# Altium schematic sheet SysUprTestUUConn.SchDoc
size 594 x 420 mm; DecimalNumber: Э- 917.04Э3; MainDevice: Плата сопряжения; Name: Плата сопряжения; PageSetup: Record=PageOptions|CenterHorizontal=True|CenterVertical=True|PrintScale=0.94|XCorrection=1.00|YCorrection=1.00|PrintKind=1|BorderSize=5000000|LeftOffset=0|BottomOffset=0|Orientation=1|PaperLength=1000|PaperWidth=1000|Scale=100|PaperSource=7|PrintQuality=-4|MediaType=1|DitherType=10|PaperKind=A4|PrintScaleMode=1; ApprovedBy: Кайбалдиев; CheckedBy: Савельев; DrawnBy: Соловьев; Engineer: Т.контр.; DocumentNumber: Э-917.04Э3; SheetTotal: 1; Title1str: Плата сопряжения; DocumentType1str: Схема электрическая; DocumentType2str: принципиальная; ImagePath: Э-917.04
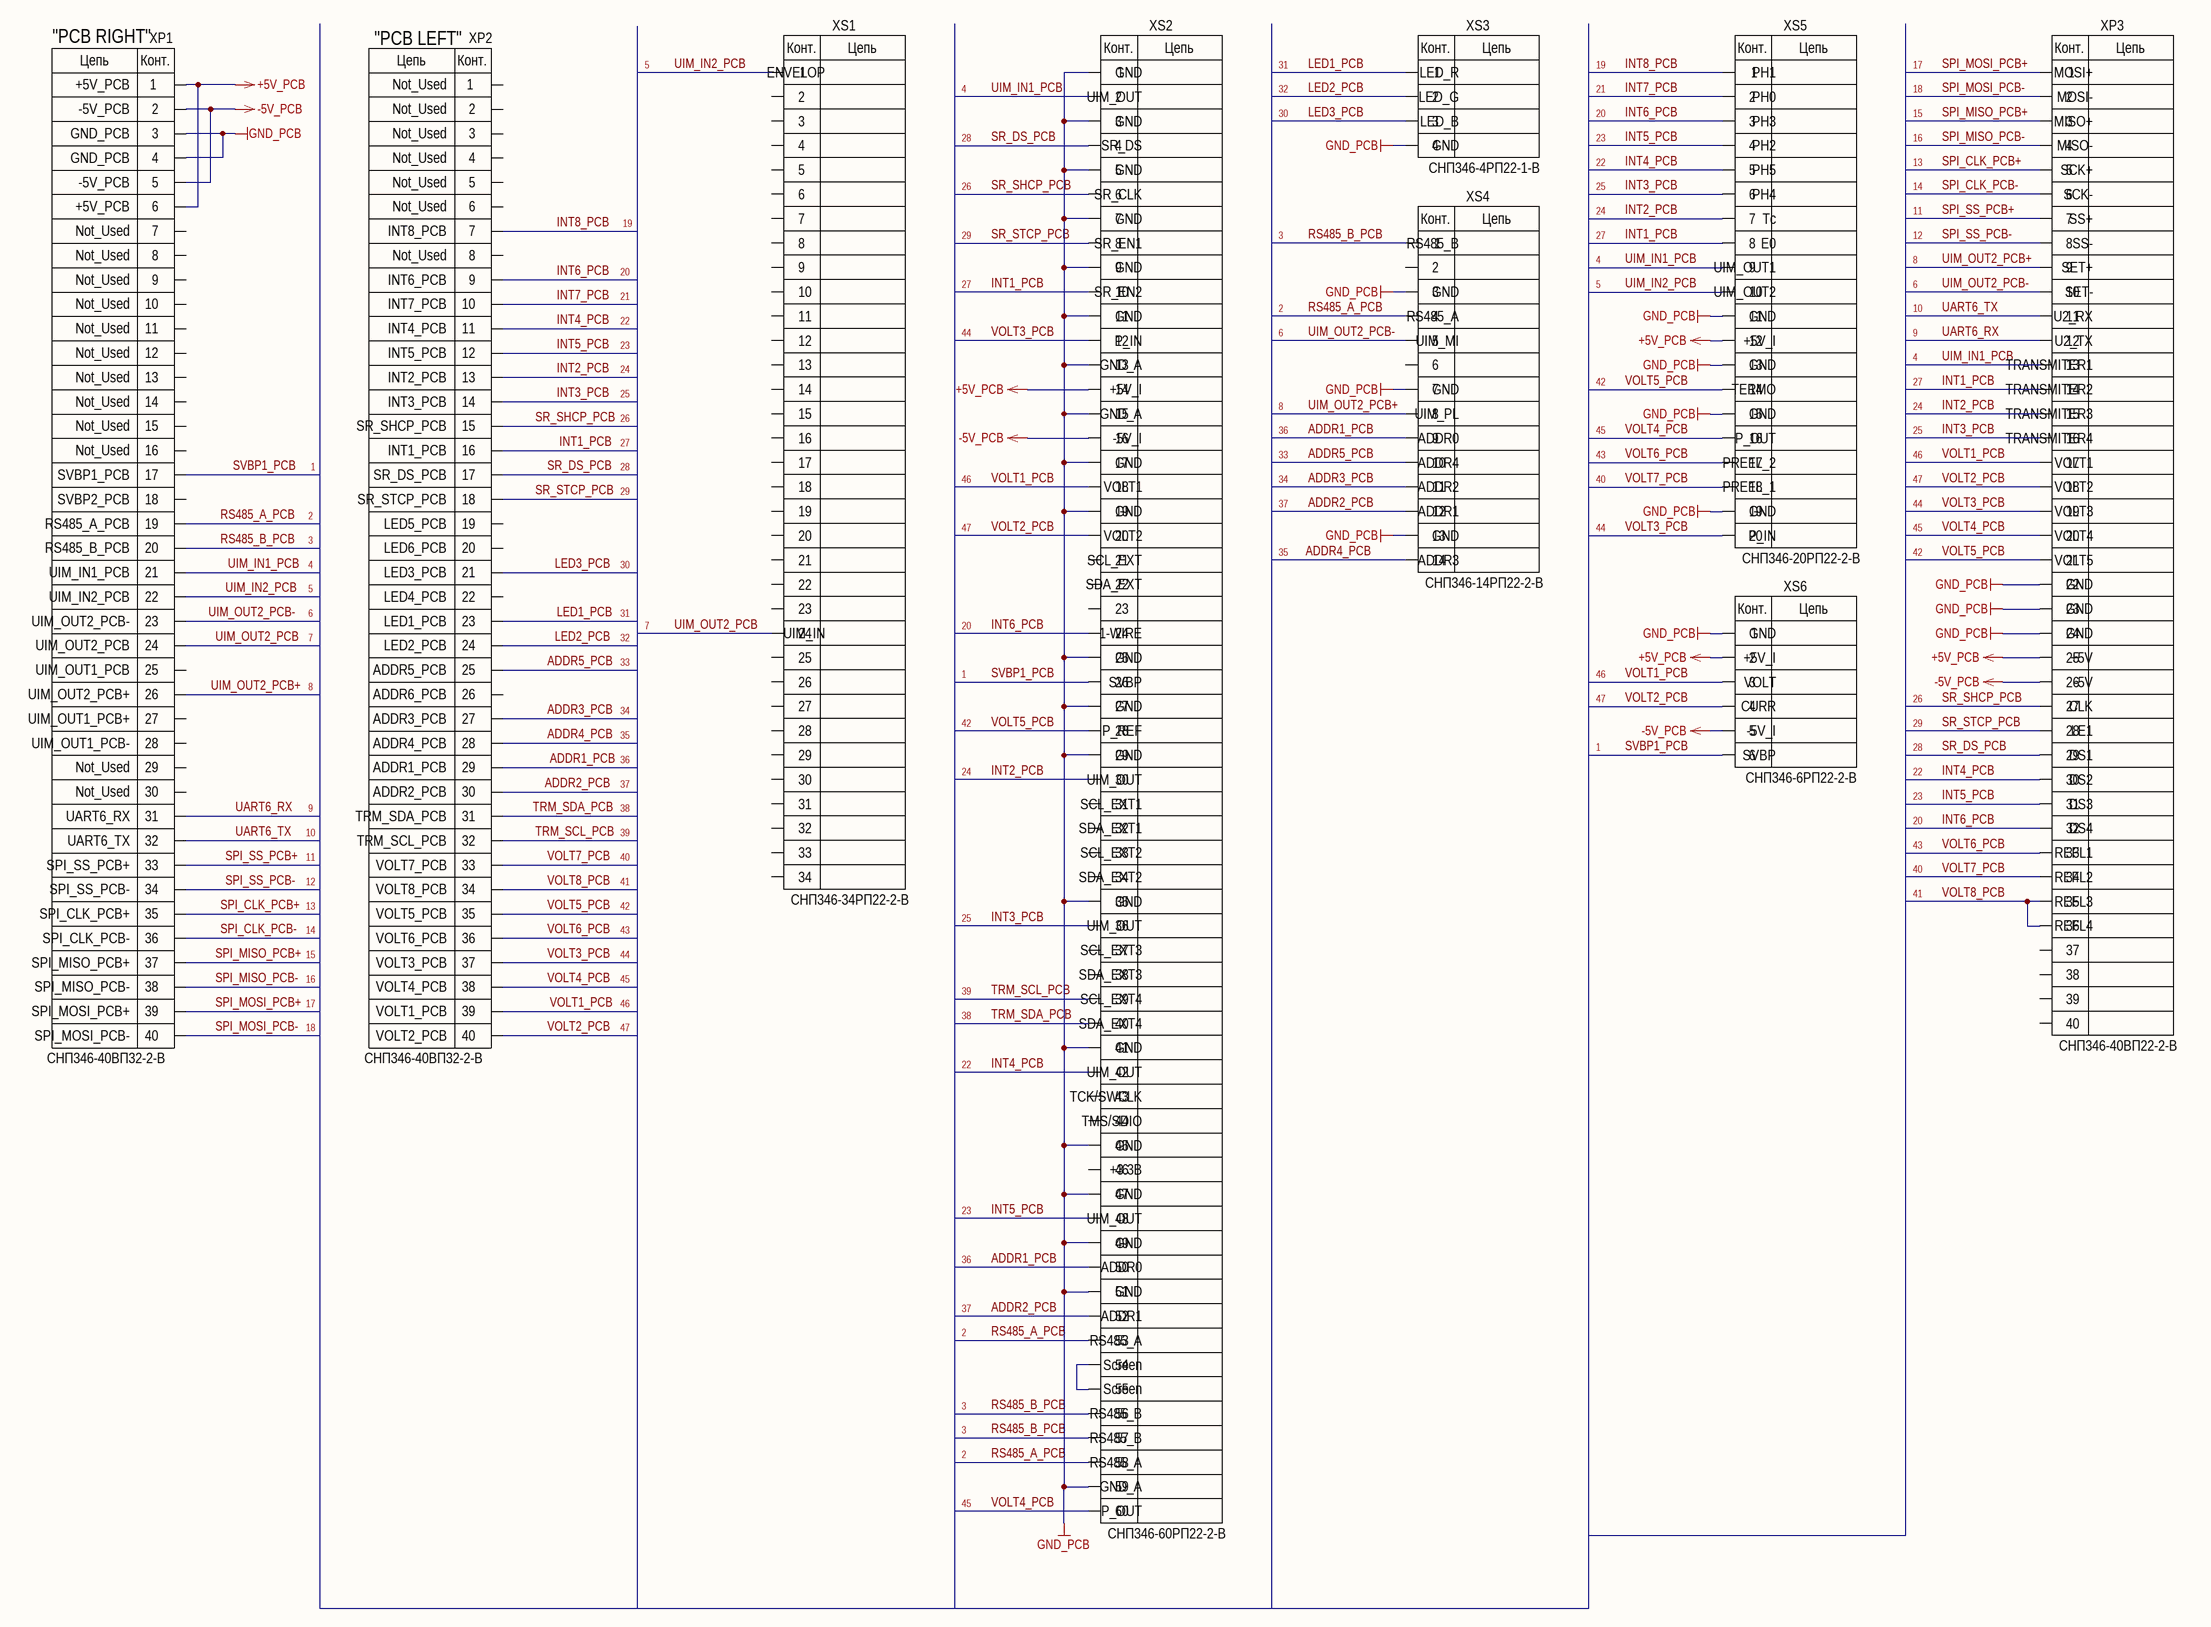
[diagram p0: SysUprTestUUConn.SchDoc]

## Parts
XP1  ConnectorP40  [PLD-40R]  (value not drawn)
XP2  ConnectorP40  [PLD-40R]  (value not drawn)
XP3  ConnectorP40  [PLD-40]  (value not drawn)
XS1  ConnectorS34  [PBD-34]  (value not drawn)
XS2  ConnectorS60  [PBD-60]  (value not drawn)
XS3  ConnectorS4  [PBS-4]  (value not drawn)
XS4  ConnectorS14  [PBD-14]  (value not drawn)
XS5  ConnectorS20  [PBD-20]  (value not drawn)
XS6  ConnectorS6  [PBD-6]  (value not drawn)

## Nets
+5V_PCB: XP1.1 XP1.6 XP3.25 XS2.14 XS5.12 XS6.2
-5V_PCB: XP1.2 XP1.5 XP3.26 XS2.16 XS6.5
GND_PCB: XP1.3 XP1.4 XP3.22 XP3.23 XP3.24 XS2.1 XS2.3 XS2.5 XS2.7 XS2.9 XS2.11 XS2.13 XS2.15 XS2.17 XS2.19 XS2.25 XS2.27 XS2.29 XS2.35 XS2.41 XS2.45 XS2.47 XS2.49 XS2.51 XS2.59 XS3.4 XS4.3 XS4.7 XS4.13 XS5.11 XS5.13 XS5.15 XS5.19 XS6.1
ADDR1_PCB: XP2.29 XS2.50 XS4.9
ADDR2_PCB: XP2.30 XS2.52 XS4.12
ADDR3_PCB: XP2.27 XS4.11
ADDR4_PCB: XP2.28 XS4.14
ADDR5_PCB: XP2.25 XS4.10
INT1_PCB: XP2.16 XP3.14 XS2.10 XS5.8
INT2_PCB: XP2.13 XP3.15 XS2.30 XS5.7
INT3_PCB: XP2.14 XP3.16 XS2.36 XS5.6
INT4_PCB: XP2.11 XP3.30 XS2.42 XS5.5
INT5_PCB: XP2.12 XP3.31 XS2.48 XS5.4
INT6_PCB: XP2.9 XP3.32 XS2.24 XS5.3
INT7_PCB: XP2.10 XS5.2
INT8_PCB: XP2.7 XS5.1
LED1_PCB: XP2.23 XS3.1
LED2_PCB: XP2.24 XS3.2
LED3_PCB: XP2.21 XS3.3
RS485_A_PCB: XP1.19 XS2.53 XS2.58 XS4.4
RS485_B_PCB: XP1.20 XS2.56 XS2.57 XS4.1
SPI_CLK_PCB+: XP1.35 XP3.5
SPI_CLK_PCB-: XP1.36 XP3.6
SPI_MISO_PCB+: XP1.37 XP3.3
SPI_MISO_PCB-: XP1.38 XP3.4
SPI_MOSI_PCB+: XP1.39 XP3.1
SPI_MOSI_PCB-: XP1.40 XP3.2
SPI_SS_PCB+: XP1.33 XP3.7
SPI_SS_PCB-: XP1.34 XP3.8
SR_DS_PCB: XP2.17 XP3.29 XS2.4
SR_SHCP_PCB: XP2.15 XP3.27 XS2.6
SR_STCP_PCB: XP2.18 XP3.28 XS2.8
SVBP1_PCB: XP1.17 XS2.26 XS6.6
TRM_SCL_PCB: XP2.32 XS2.39
TRM_SDA_PCB: XP2.31 XS2.40
UART6_RX: XP1.31 XP3.12
UART6_TX: XP1.32 XP3.11
UIM_IN1_PCB: XP1.21 XP3.13 XS2.2 XS5.9
UIM_IN2_PCB: XP1.22 XS1.1 XS5.10
UIM_OUT2_PCB: XP1.24 XS1.24
UIM_OUT2_PCB+: XP1.26 XP3.9 XS4.8
UIM_OUT2_PCB-: XP1.23 XP3.10 XS4.5
VOLT1_PCB: XP2.39 XP3.17 XS2.18 XS6.3
VOLT2_PCB: XP2.40 XP3.18 XS2.20 XS6.4
VOLT3_PCB: XP2.37 XP3.19 XS2.12 XS5.20
VOLT4_PCB: XP2.38 XP3.20 XS2.60 XS5.16
VOLT5_PCB: XP2.35 XP3.21 XS2.28 XS5.14
VOLT6_PCB: XP2.36 XP3.33 XS5.17
VOLT7_PCB: XP2.33 XP3.34 XS5.18
VOLT8_PCB: XP2.34 XP3.35 XP3.36
NetXS2_54: XS2.54 XS2.55

Not connected (* = marked no-connect by the designer): XP1 7 8 9 10 11 12 13 14 15 16 18 25 27 28 29 30; XP2 1 2 3 4 5 6 8 19 20 22 26; XP3 37 38 39 40; XS1 2 3 4 5 6 7 8 9 10 11 12 13 14 15 16 17 18 19 20 21 22 23 25 26 27 28 29 30 31 32 33 34; XS2 21 22 23 31 32 33 34 37 38 43 44 46; XS4 2 6

## Notes on the sheet
- "PCB RIGHT"
- "PCB LEFT"
- 5
- 31
- 19
- 17
- 4
- 30
- 32
- 20
- 21
- 15
- 18
- 26
- 28
- 22
- 23
- 25
- 13
- 14
- 16
- 29
- 3
- 24
- 27
- 11
- 12
- 2
- 6
- 8
- 10
- 44
- 9
- 36
- 42
- 45
- 1
- 46
- 33
- 34
- 40
- 43
- 47
- 35
- 37
- 7
- 38
- 39
- 41
- Перв. примен.
- Справ. №
- Подп. и дата
- Инв. № дубл.
- Взам. инв. №
- Изм.
- Лист
- № докум.
- Подп.
- Дата
- Лит.
- Масса
- Масштаб
- Т.контр.
- Пров.
- Разраб.
- Листов
- Инв. № подл.
- Н.контр.
- Утв.
- Копировал
- Формат А2
- (in symbol 60) Конт.; Цепь
- (in symbol 64) Конт.; Цепь
- (in symbol 103) Конт.; Цепь
- (in symbol 107) Конт.; Цепь
- (in symbol 110) Конт.; Цепь
- (in symbol 117) Конт.; Цепь
- (in symbol 338) Цепь; Конт.
- (in symbol 455) Конт.; Цепь

## Library data of the parts
XP1 = 338: Manufacturer: АО «Карачевский завод Электродеталь»; ManufacturerTU: РЮМК.430420.011ТУ; PartNumber: Вилка СНП346-40ВП32-2-В; Conn01Name: +5V_PCB; Conn02Name: -5V_PCB; Conn03Name: GND_PCB; Conn07Name: Not_Used; Conn17Name: SVBP1_PCB; Conn18Name: SVBP2_PCB; Conn19Name: RS485_A_PCB; Conn20Name: RS485_B_PCB; Conn21Name: UIM_IN1_PCB; Conn22Name: UIM_IN2_PCB; Conn23Name: UIM_OUT2_PCB-; Conn24Name: UIM_OUT2_PCB; Conn25Name: UIM_OUT1_PCB; Conn26Name: UIM_OUT2_PCB+; Conn27Name: UIM_OUT1_PCB+; Conn28Name: UIM_OUT1_PCB-; Conn31Name: UART6_RX; Conn32Name: UART6_TX; Conn33Name: SPI_SS_PCB+; Conn34Name: SPI_SS_PCB-; Conn35Name: SPI_CLK_PCB+; Conn36Name: SPI_CLK_PCB-; Conn37Name: SPI_MISO_PCB+; Conn38Name: SPI_MISO_PCB-; Conn39Name: SPI_MOSI_PCB+; Conn40Name: SPI_MOSI_PCB-; Alternative2: СНП346-40ВП32-2 РЮМК.430420.019ТУ; Name: СНП346-40ВП32-2-В; Value: 40; Group: Соединители; ViewControl: В, 10%; key: 338; SolderName: SNP346-40VP32-2; Mass: 0,0024; TemperatureRange: от минус 60 до 85; CardKRR: 75; VoltageLimit: 250; CurrentLimit: 1; X_SORT_1: 700; X_SORT_2: 600; Conn04Name: GND_PCB; Conn05Name: -5V_PCB; Conn06Name: +5V_PCB; Conn08Name: Not_Used; Conn09Name: Not_Used; Conn10Name: Not_Used; Conn11Name: Not_Used; Conn12Name: Not_Used; Conn13Name: Not_Used; Conn14Name: Not_Used; Conn15Name: Not_Used; Conn16Name: Not_Used; Conn29Name: Not_Used; Conn30Name: Not_Used; Alternative: PLD-40R; MilitaryControl: ВП; MountType: РМ; Modify: 22.01.2019; Package: PLD-R; ComponentLink1Description: СНП346; ComponentLink1URL: \\192.168.0.101\U_Base\PDF\X\СНП346.pdf; HelpURL: \\192.168.0.101\U_Base\PDF\X\СНП346.pdf; DataSheet: #\\192.168.0.101\U_Base\PDF\X\СНП346.pdf#; PowerLimit: 250; X_SORT_3: 1
XP2 = 338: Manufacturer: АО «Карачевский завод Электродеталь»; ManufacturerTU: РЮМК.430420.011ТУ; PartNumber: Вилка СНП346-40ВП32-2-В; Conn01Name: Not_Used; Conn07Name: INT8_PCB; Conn09Name: INT6_PCB; Conn10Name: INT7_PCB; Conn11Name: INT4_PCB; Conn12Name: INT5_PCB; Conn13Name: INT2_PCB; Conn14Name: INT3_PCB; Conn15Name: SR_SHCP_PCB; Conn16Name: INT1_PCB; Conn17Name: SR_DS_PCB; Conn18Name: SR_STCP_PCB; Conn19Name: LED5_PCB; Conn20Name: LED6_PCB; Conn21Name: LED3_PCB; Conn22Name: LED4_PCB; Conn23Name: LED1_PCB; Conn24Name: LED2_PCB; Conn25Name: ADDR5_PCB; Conn26Name: ADDR6_PCB; Conn27Name: ADDR3_PCB; Conn28Name: ADDR4_PCB; Conn29Name: ADDR1_PCB; Conn30Name: ADDR2_PCB; Conn31Name: TRM_SDA_PCB; Conn32Name: TRM_SCL_PCB; Conn33Name: VOLT7_PCB; Conn34Name: VOLT8_PCB; Conn35Name: VOLT5_PCB; Conn36Name: VOLT6_PCB; Conn37Name: VOLT3_PCB; Conn38Name: VOLT4_PCB; Conn39Name: VOLT1_PCB; Conn40Name: VOLT2_PCB; Alternative2: СНП346-40ВП32-2 РЮМК.430420.019ТУ; Name: СНП346-40ВП32-2-В; Value: 40; Group: Соединители; ViewControl: В, 10%; key: 338; SolderName: SNP346-40VP32-2; Mass: 0,0024; TemperatureRange: от минус 60 до 85; CardKRR: 75; VoltageLimit: 250; CurrentLimit: 1; X_SORT_1: 700; X_SORT_2: 600; Conn02Name: Not_Used; Conn03Name: Not_Used; Conn04Name: Not_Used; Conn05Name: Not_Used; Conn06Name: Not_Used; Conn08Name: Not_Used; Alternative: PLD-40R; MilitaryControl: ВП; MountType: РМ; Modify: 22.01.2019; Package: PLD-R; ComponentLink1Description: СНП346; ComponentLink1URL: \\192.168.0.101\U_Base\PDF\X\СНП346.pdf; HelpURL: \\192.168.0.101\U_Base\PDF\X\СНП346.pdf; DataSheet: #\\192.168.0.101\U_Base\PDF\X\СНП346.pdf#; PowerLimit: 250; X_SORT_3: 1
XP3 = 60: Manufacturer: АО «Карачевский завод Электродеталь»; ManufacturerTU: РЮМК.430420.011ТУ; PartNumber: Вилка СНП346-40ВП22-2-В; Conn01Name: MOSI+; Conn02Name: MOSI-; Conn03Name: MISO+; Conn04Name: MISO-; Conn05Name: SCK+; Conn06Name: SCK-; Conn07Name: SS+; Conn08Name: SS-; Conn09Name: SET+; Conn10Name: SET-; Conn11Name: U2_RX; Conn12Name: U2_TX; Conn13Name: TRANSMITER1; Conn14Name: TRANSMITER2; Conn15Name: TRANSMITER3; Conn16Name: TRANSMITER4; Conn17Name: VOLT1; Conn18Name: VOLT2; Conn19Name: VOLT3; Conn20Name: VOLT4; Conn21Name: VOLT5; Conn22Name: GND; Conn25Name: +5V; Conn26Name: -5V; Conn27Name: CLK; Conn28Name: LE1; Conn29Name: DS1; Conn30Name: DS2; Conn31Name: DS3; Conn32Name: DS4; Conn33Name: REFL1; Conn34Name: REFL2; Conn35Name: REFL3; Conn36Name: REFL4; Alternative2: СНП346-40ВП22-2 РЮМК.430420.019ТУ; Name: СНП346-40ВП22-2-В; Value: 40; Group: Соединители; ViewControl: В, 10%; key: 60; SolderName: SNP346-40VP22-2; Mass: 0,0024; TemperatureRange: от минус 60 до 85; CardKRR: 75; VoltageLimit: 250; CurrentLimit: 1; X_SORT_1: 700; X_SORT_2: 600; Conn23Name: GND; Conn24Name: GND; Alternative: PLD-40; MilitaryControl: ВП; MountType: РМ; Modify: 19.09.2018; Package: PLD; ComponentLink1Description: СНП346; ComponentLink1URL: \\192.168.0.101\U_Base\PDF\X\СНП346.pdf; HelpURL: \\192.168.0.101\U_Base\PDF\X\СНП346.pdf; DataSheet: #\\192.168.0.101\U_Base\PDF\X\СНП346.pdf#; PowerLimit: 250; X_SORT_3: 1
XS1 = 117: Manufacturer: АО «Карачевский завод Электродеталь»; ManufacturerTU: РЮМК.430420.011ТУ; PartNumber: Розетка СНП346-34РП22-2-В; Conn35Name: 35; Conn36Name: 36; Conn37Name: 37; Conn38Name: 38; Conn39Name: 39; Conn40Name: 40; Conn01Name: ENVELOP; Conn24Name: UIM_IN; Alternative2: СНП346-34РП22-2 РЮМК.430420.019ТУ; Name: СНП346-34РП22-2-В; Value: 34; Group: Соединители; ViewControl: В, 10%; key: 117; SolderName: SNP346-34RP22-2; Mass: 0,00306; TemperatureRange: от минус 60 до 85; CardKRR: 75; VoltageLimit: 250; CurrentLimit: 1; X_SORT_1: 700; X_SORT_2: 600; Alternative: PBD-34; MilitaryControl: ВП; MountType: РМ; Modify: 19.09.2018; Package: PBD; ComponentLink1Description: СНП346; ComponentLink1URL: \\192.168.0.101\U_Base\PDF\X\СНП346.pdf; HelpURL: \\192.168.0.101\U_Base\PDF\X\СНП346.pdf; DataSheet: #\\192.168.0.101\U_Base\PDF\X\СНП346.pdf#; PowerLimit: 250; X_SORT_3: 1
XS2 = 455: Manufacturer: АО «Карачевский завод Электродеталь»; ManufacturerTU: РЮМК.430420.011ТУ; PartNumber: Розетка СНП346-60РП22-2-В; Conn01Name: GND; Conn02Name: UIM_OUT; Conn04Name: SR_DS; Conn06Name: SR_CLK; Conn08Name: SR_EN1; Conn10Name: SR_EN2; Conn12Name: P_IN; Conn13Name: GND_A; Conn14Name: +5V_I; Conn16Name: -5V_I; Conn18Name: VOLT1; Conn20Name: VOLT2; Conn21Name: SCL_EXT; Conn22Name: SDA_EXT; Conn24Name: 1-WIRE; Conn26Name: SVBP; Conn28Name: P_REF; Conn31Name: SCL_EXT1; Conn32Name: SDA_EXT1; Conn33Name: SCL_EXT2; Conn34Name: SDA_EXT2; Conn37Name: SCL_EXT3; Conn38Name: SDA_EXT3; Conn39Name: SCL_EXT4; Conn40Name: SDA_EXT4; Conn43Name: TCK/SWCLK; Conn44Name: TMS/SDIO; Conn46Name: +3.3В; Conn50Name: ADDR0; Conn52Name: ADDR1; Conn53Name: RS485_A; Conn54Name: Screen; Conn56Name: RS485_B; Conn60Name: P_OUT; Alternative2: СНП346-60РП22-2 РЮМК.430420.019ТУ; Name: СНП346-60РП22-2-В; Value: 60; Group: Соединители; ViewControl: В, 10%; key: 455; SolderName: SNP346-60RP22-2; Mass: 0,0036; TemperatureRange: от минус 60 до 85; CardKRR: 75; VoltageLimit: 250; CurrentLimit: 1; X_SORT_1: 700; X_SORT_2: 600; Conn03Name: GND; Conn05Name: GND; Conn07Name: GND; Conn09Name: GND; Conn11Name: GND; Conn15Name: GND_A; Conn17Name: GND; Conn19Name: GND; Conn25Name: GND; Conn27Name: GND; Conn29Name: GND; Conn30Name: UIM_OUT; Conn35Name: GND; Conn36Name: UIM_OUT; Conn41Name: GND; Conn42Name: UIM_OUT; Conn45Name: GND; Conn47Name: GND; Conn48Name: UIM_OUT; Conn49Name: GND; Conn51Name: GND; Conn55Name: Screen; Conn57Name: RS485_B; Conn58Name: RS485_A; Conn59Name: GND_A; Alternative: PBD-60; MilitaryControl: ВП; MountType: РМ; Modify: 07.02.2023; Package: PBD; ComponentLink1Description: СНП346; ComponentLink1URL: \\192.168.0.101\U_Base\PDF\X\СНП346.pdf; HelpURL: \\192.168.0.101\U_Base\PDF\X\СНП346.pdf; DataSheet: #\\192.168.0.101\U_Base\PDF\X\СНП346.pdf#; PowerLimit: 250; X_SORT_3: 1
XS3 = 64: Manufacturer: АО «Карачевский завод Электродеталь»; ManufacturerTU: РЮМК.430420.011ТУ; PartNumber: Розетка СНП346-4РП22-1-В; Conn05Name: 5; Conn06Name: 6; Conn07Name: 7; Conn08Name: 8; Conn09Name: 9; Conn10Name: 10; Conn11Name: 11; Conn12Name: 12; Conn13Name: 13; Conn14Name: 14; Conn15Name: 15; Conn16Name: 16; Conn17Name: 17; Conn18Name: 18; Conn19Name: 19; Conn20Name: 20; Conn21Name: 21; Conn22Name: 22; Conn23Name: 23; Conn24Name: 24; Conn25Name: 25; Conn26Name: 26; Conn27Name: 27; Conn28Name: 28; Conn29Name: 29; Conn30Name: 30; Conn31Name: 31; Conn32Name: 32; Conn33Name: 33; Conn34Name: 34; Conn35Name: 35; Conn36Name: 36; Conn37Name: 37; Conn38Name: 38; Conn39Name: 39; Conn40Name: 40; Conn02Name: LED_G; Conn03Name: LED_B; Conn04Name: GND; Conn01Name: LED_R; Alternative2: СНП346-4РП22-1 РЮМК.430420.019ТУ; Name: СНП346-4РП22-1-В; Value: 4; Group: Соединители; ViewControl: В, 10%; key: 64; SolderName: SNP346-4RP22-1; Mass: 0,0004; TemperatureRange: от минус 60 до 85; CardKRR: 75; VoltageLimit: 250; CurrentLimit: 1; X_SORT_1: 700; X_SORT_2: 600; Alternative: PBS-4; MilitaryControl: ВП; MountType: РМ; Modify: 19.09.2018; Package: PBS; ComponentLink1Description: СНП346; ComponentLink1URL: \\192.168.0.101\U_Base\PDF\X\СНП346.pdf; HelpURL: \\192.168.0.101\U_Base\PDF\X\СНП346.pdf; DataSheet: #\\192.168.0.101\U_Base\PDF\X\СНП346.pdf#; PowerLimit: 250; X_SORT_3: 1
XS4 = 107: Manufacturer: АО «Карачевский завод Электродеталь»; ManufacturerTU: РЮМК.430420.011ТУ; PartNumber: Розетка СНП346-14РП22-2-В; Conn15Name: 15; Conn16Name: 16; Conn17Name: 17; Conn18Name: 18; Conn19Name: 19; Conn20Name: 20; Conn21Name: 21; Conn22Name: 22; Conn23Name: 23; Conn24Name: 24; Conn25Name: 25; Conn26Name: 26; Conn27Name: 27; Conn28Name: 28; Conn29Name: 29; Conn30Name: 30; Conn31Name: 31; Conn32Name: 32; Conn33Name: 33; Conn34Name: 34; Conn35Name: 35; Conn36Name: 36; Conn37Name: 37; Conn38Name: 38; Conn39Name: 39; Conn40Name: 40; Conn14Name: ADDR3; Conn13Name: GND; Conn12Name: ADDR1; Conn11Name: ADDR2; Conn10Name: ADDR4; Conn09Name: ADDR0; Conn08Name: UIM_PL; Conn05Name: UIM_MI; Conn04Name: RS485_A; Conn01Name: RS485_B; Alternative2: СНП346-14РП22-2 РЮМК.430420.019ТУ; Name: СНП346-14РП22-2-В; Value: 14; Group: Соединители; ViewControl: В, 10%; key: 107; SolderName: SNP346-14RP22-2; Mass: 0,00126; TemperatureRange: от минус 60 до 85; CardKRR: 75; VoltageLimit: 250; CurrentLimit: 1; X_SORT_1: 700; X_SORT_2: 600; Conn07Name: GND; Conn03Name: GND; Alternative: PBD-14; MilitaryControl: ВП; MountType: РМ; Modify: 19.09.2018; Package: PBD; ComponentLink1Description: СНП346; ComponentLink1URL: \\192.168.0.101\U_Base\PDF\X\СНП346.pdf; HelpURL: \\192.168.0.101\U_Base\PDF\X\СНП346.pdf; DataSheet: #\\192.168.0.101\U_Base\PDF\X\СНП346.pdf#; PowerLimit: 250; X_SORT_3: 1
XS5 = 110: Manufacturer: АО «Карачевский завод Электродеталь»; ManufacturerTU: РЮМК.430420.011ТУ; PartNumber: Розетка СНП346-20РП22-2-В; Conn21Name: 21; Conn22Name: 22; Conn23Name: 23; Conn24Name: 24; Conn25Name: 25; Conn26Name: 26; Conn27Name: 27; Conn28Name: 28; Conn29Name: 29; Conn30Name: 30; Conn31Name: 31; Conn32Name: 32; Conn33Name: 33; Conn34Name: 34; Conn35Name: 35; Conn36Name: 36; Conn37Name: 37; Conn38Name: 38; Conn39Name: 39; Conn40Name: 40; Conn01Name: PH1; Conn02Name: PH0; Conn03Name: PH3; Conn04Name: PH2; Conn05Name: PH5; Conn06Name: PH4; Conn07Name: Tc; Conn08Name: E0; Conn09Name: UIM_OUT1; Conn10Name: UIM_OUT2; Conn11Name: GND; Conn12Name: +5V_I; Conn14Name: TERMO; Conn16Name: P_OUT; Conn17Name: PREFL_2; Conn18Name: PREFL_1; Conn20Name: P_IN; Alternative2: СНП346-20РП22-2 РЮМК.430420.019ТУ; Name: СНП346-20РП22-2-В; Value: 20; Group: Соединители; ViewControl: В, 10%; key: 110; SolderName: SNP346-20RP22-2; Mass: 0,0018; TemperatureRange: от минус 60 до 85; CardKRR: 75; VoltageLimit: 250; CurrentLimit: 1; X_SORT_1: 700; X_SORT_2: 600; Conn13Name: GND; Conn15Name: GND; Conn19Name: GND; Alternative: PBD-20; MilitaryControl: ВП; MountType: РМ; Modify: 19.09.2018; Package: PBD; ComponentLink1Description: СНП346; ComponentLink1URL: \\192.168.0.101\U_Base\PDF\X\СНП346.pdf; HelpURL: \\192.168.0.101\U_Base\PDF\X\СНП346.pdf; DataSheet: #\\192.168.0.101\U_Base\PDF\X\СНП346.pdf#; PowerLimit: 250; X_SORT_3: 1
XS6 = 103: Manufacturer: АО «Карачевский завод Электродеталь»; ManufacturerTU: РЮМК.430420.011ТУ; PartNumber: Розетка СНП346-6РП22-2-В; Conn07Name: 7; Conn08Name: 8; Conn09Name: 9; Conn10Name: 10; Conn11Name: 11; Conn12Name: 12; Conn13Name: 13; Conn14Name: 14; Conn15Name: 15; Conn16Name: 16; Conn17Name: 17; Conn18Name: 18; Conn19Name: 19; Conn20Name: 20; Conn21Name: 21; Conn22Name: 22; Conn23Name: 23; Conn24Name: 24; Conn25Name: 25; Conn26Name: 26; Conn27Name: 27; Conn28Name: 28; Conn29Name: 29; Conn30Name: 30; Conn31Name: 31; Conn32Name: 32; Conn33Name: 33; Conn34Name: 34; Conn35Name: 35; Conn36Name: 36; Conn37Name: 37; Conn38Name: 38; Conn39Name: 39; Conn40Name: 40; Conn01Name: GND; Conn02Name: +5V_I; Conn03Name: VOLT; Conn04Name: CURR; Conn05Name: -5V_I; Conn06Name: SVBP; Alternative2: СНП346-6РП22-2 РЮМК.430420.019ТУ; Name: СНП346-6РП22-2-В; Value: 6; Group: Соединители; ViewControl: В, 10%; key: 103; SolderName: SNP346-6RP22-2; Mass: 0,00054; TemperatureRange: от минус 60 до 85; CardKRR: 75; VoltageLimit: 250; CurrentLimit: 1; X_SORT_1: 700; X_SORT_2: 600; Alternative: PBD-6; MilitaryControl: ВП; MountType: РМ; Modify: 19.09.2018; Package: PBD; ComponentLink1Description: СНП346; ComponentLink1URL: \\192.168.0.101\U_Base\PDF\X\СНП346.pdf; HelpURL: \\192.168.0.101\U_Base\PDF\X\СНП346.pdf; DataSheet: #\\192.168.0.101\U_Base\PDF\X\СНП346.pdf#; PowerLimit: 250; X_SORT_3: 1